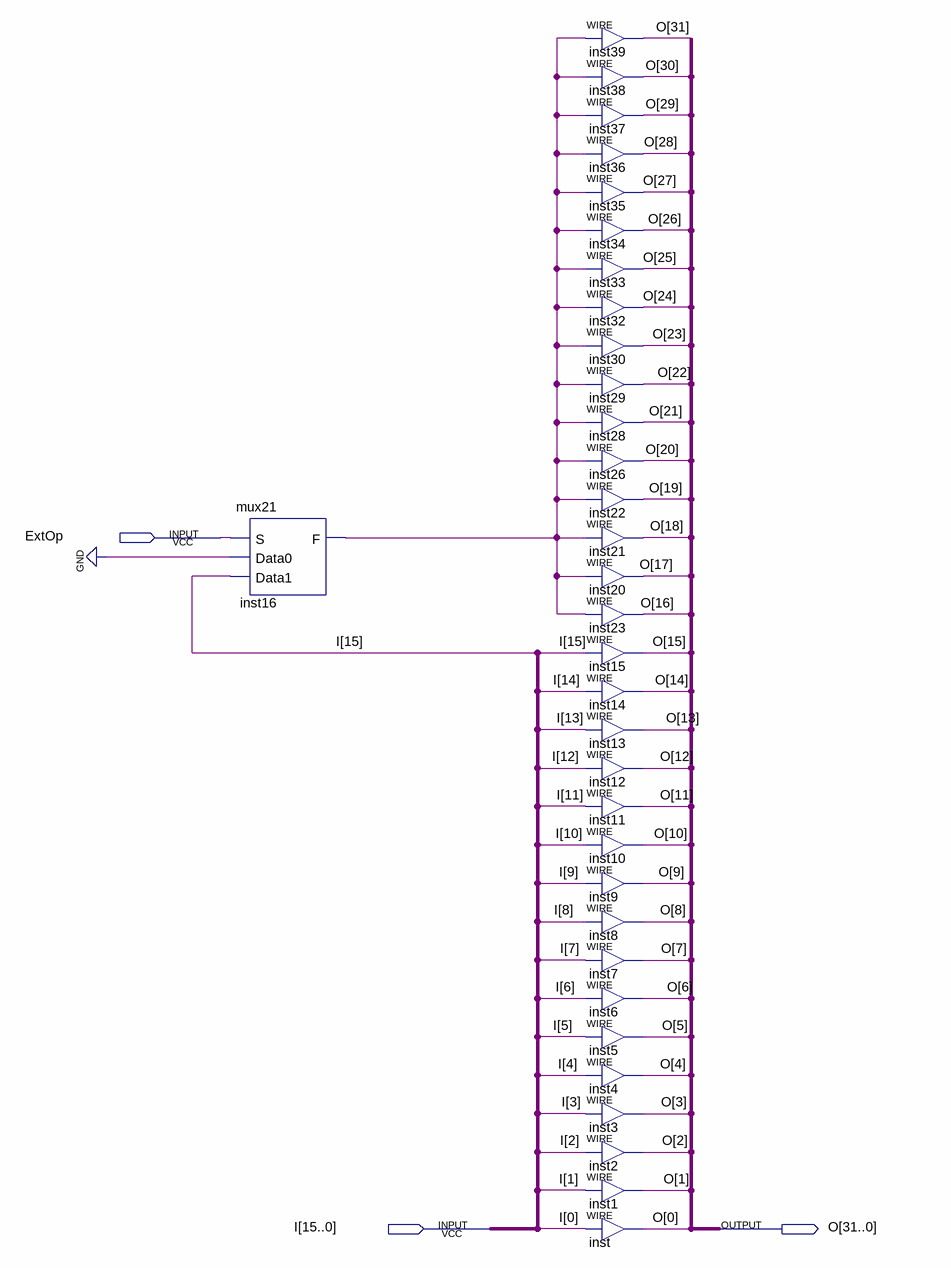
[diagram p0: schematic sheet]
// Quartus schematic Extend16to32.bdf as structural Verilog: 33 symbols, 3 pins
module Extend16to32 (
  input  ExtOp,
  input  [15:0] I,
  output [31:0] O
);

  wire inst16_f;

  mux21 inst16 (.S(ExtOp), .Data0(1'b0), .Data1(I[15]), .F(inst16_f));
  assign O[31] = inst16_f;  // WIRE inst39
  assign O[30] = inst16_f;  // WIRE inst38
  assign O[29] = inst16_f;  // WIRE inst37
  assign O[28] = inst16_f;  // WIRE inst36
  assign O[27] = inst16_f;  // WIRE inst35
  assign O[26] = inst16_f;  // WIRE inst34
  assign O[25] = inst16_f;  // WIRE inst33
  assign O[24] = inst16_f;  // WIRE inst32
  assign O[23] = inst16_f;  // WIRE inst30
  assign O[22] = inst16_f;  // WIRE inst29
  assign O[21] = inst16_f;  // WIRE inst28
  assign O[20] = inst16_f;  // WIRE inst26
  assign O[19] = inst16_f;  // WIRE inst22
  assign O[18] = inst16_f;  // WIRE inst21
  assign O[17] = inst16_f;  // WIRE inst20
  assign O[16] = inst16_f;  // WIRE inst23
  assign O[15] = I[15];  // WIRE inst15
  assign O[14] = I[14];  // WIRE inst14
  assign O[13] = I[13];  // WIRE inst13
  assign O[12] = I[12];  // WIRE inst12
  assign O[11] = I[11];  // WIRE inst11
  assign O[10] = I[10];  // WIRE inst10
  assign O[9] = I[9];  // WIRE inst9
  assign O[8] = I[8];  // WIRE inst8
  assign O[7] = I[7];  // WIRE inst7
  assign O[6] = I[6];  // WIRE inst6
  assign O[5] = I[5];  // WIRE inst5
  assign O[4] = I[4];  // WIRE inst4
  assign O[3] = I[3];  // WIRE inst3
  assign O[2] = I[2];  // WIRE inst2
  assign O[1] = I[1];  // WIRE inst1
  assign O[0] = I[0];  // WIRE inst
endmodule
